# EAGLE design CANFD_module (EAGLE 9.6.2)
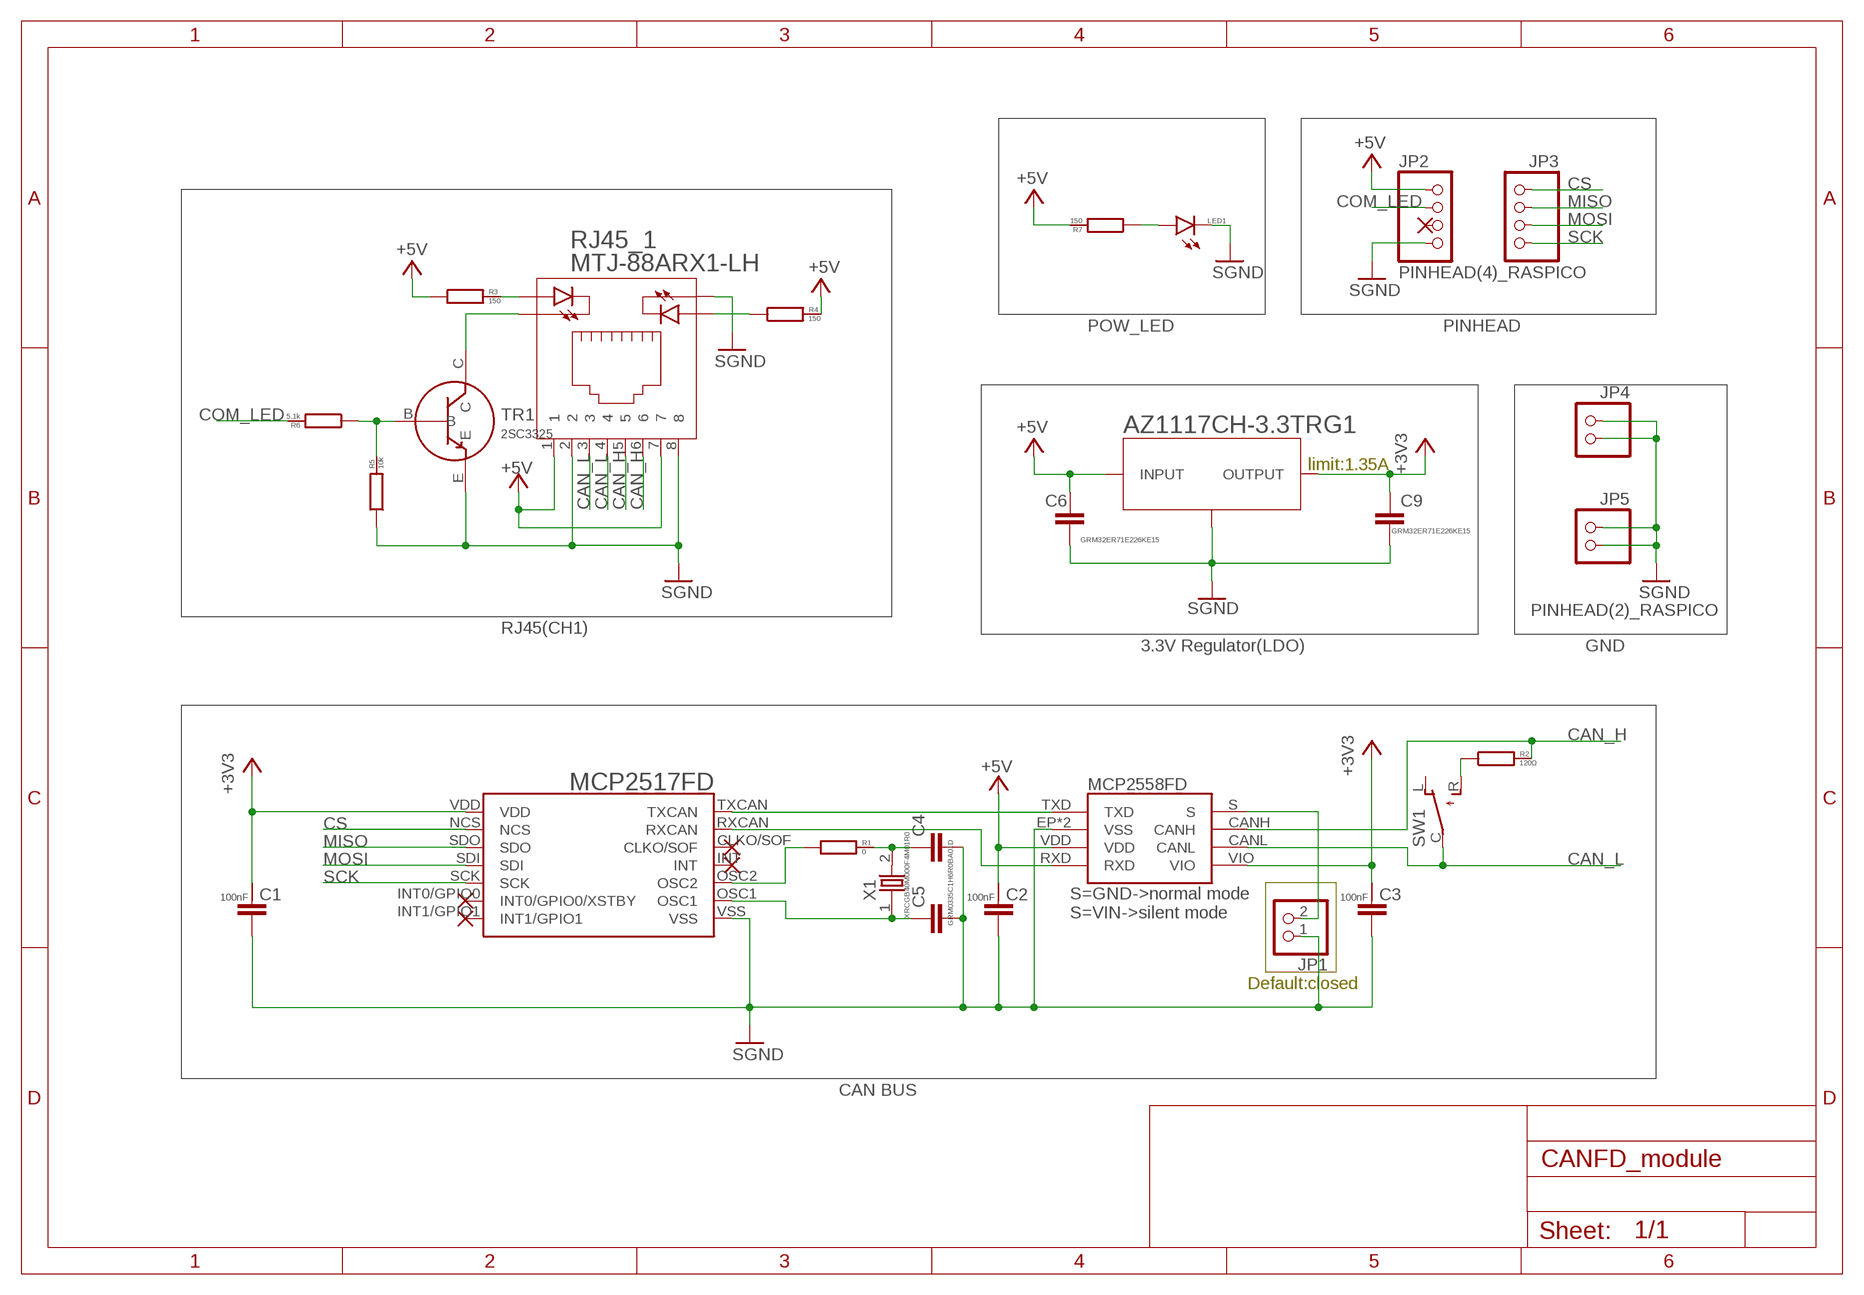
[diagram p0: schematic, sheet 1]

## Parts
C1  GCM188L81H104KA57  [GCM188L81H104KA57]
C2  GCM188L81H104KA57  [GCM188L81H104KA57]
C3  GCM188L81H104KA57  [GCM188L81H104KA57]
C4  GRM0335C1H6R0BA01D  [GRM0335C1H120GA01]
C5  GRM0335C1H6R0BA01D  [GRM0335C1H120GA01]
C6  GRM32ER71E226KE15  [3225M]
C9  GRM32ER71E226KE15  [3225M]
JP1  PINHD-1X2  [1X02]
JP2  PINHEAD(4)_RASPICO  [1X04]
JP3  PINHEAD(4)_RASPICO  [1X04]
JP4  PINHEAD(2)_RASPICO  [PINHEAD_2_RASPICO]
JP5  PINHEAD(2)_RASPICO  [PINHEAD_2_RASPICO]
LED1  SML-E12V8WT86  [SML-E12V8WT86]
R1  0  CR0603  [CR0603]
R2  120Ω  CR0603  [CR0603]
R3  150  CR0603  [CR0603]
R4  150  CR0603  [CR0603]
R5  10k  CR0603  [CR0603]
R6  5.1k  CR0603  [CR0603]
R7  150  CR0603  [CR0603]
RJ45_1  MTJ-88ARX1-LH  [MTJ-88ARX1-LH]
SW1  SS-12SDP2  [SS-12SDP2]
TR1  2SC3325  [2SC3325]
U2  MCP2517FD  [MCP2517FD]
U$1  MCP2558FD  [MCP2558FD]
U$4  AZ1117CH-3.3TRG1  [AZ1117C]
X1  XRCGB40M000F4M01R0  [XRCGB40M000F4M00R0]

## Nets
+3V3: C1.P$1 C3.P$1 C9.L U2.VDD U$1.VIO U$4.OUTPUT U$4.VOUT(OUTPUT)
+5V: C2.P$1 C6.L JP2.PIN1 JP2.PIN1_ R3.LEFT R4.RIGHT R7.RIGHT RJ45_1.1 RJ45_1.7 U$1.VDD U$4.INPUT
CAN_H: R2.RIGHT RJ45_1.5 RJ45_1.6 U$1.CANH
CAN_L: RJ45_1.3 RJ45_1.4 SW1.C U$1.CANL
COM_LED: JP2.PIN2 JP2.PIN2_ R6.RIGHT
CS: JP3.PIN1 JP3.PIN1_ U2.NCS
MISO: JP3.PIN2 JP3.PIN2_ U2.SDO
MOSI: JP3.PIN3 JP3.PIN3_ U2.SDI
N$1: LED1.A R7.LEFT
N$23: R2.LEFT SW1.R
N$27: U2.TXCAN U$1.TXD
N$28: U2.RXCAN U$1.RXD
N$38: R1.LEFT U2.OSC2
N$39: C5.1 U2.OSC1 X1.1
N$42: C4.1 R1.RIGHT X1.2
N$51: R4.LEFT RJ45_1.LED2_A
N$68: JP1.2 U$1.S
N$69: R3.RIGHT RJ45_1.LED1_A
N$71: RJ45_1.LED1_K TR1.C
N$74: R5.RIGHT R6.LEFT TR1.B
SCK: JP3.PIN4 JP3.PIN4_ U2.SCK
SGND: C1.P$2 C2.P$2 C3.P$2 C4.2 C5.2 C6.R C9.R JP1.1 JP2.PIN4 JP2.PIN4_ JP4.PIN1 JP4.PIN1_ JP4.PIN2 JP4.PIN2_ JP5.PIN1 JP5.PIN1_ JP5.PIN2 JP5.PIN2_ LED1.K(C) R5.LEFT RJ45_1.2 RJ45_1.8 RJ45_1.LED2_K TR1.E U2.VSS U$1.EP(VSS) U$1.VSS U$4.GND ; supply symbol labelled GND
Unconnected: JP2.PIN3 JP2.PIN3_ SW1.L U2.CLKO/SOF U2.INT U2.INT0/GPIO0(INT0/GPIO0/XSTBY) U2.INT1/GPIO1

## Notes on the sheet
- POW_LED | PINHEAD
- limit:1.35A
- RJ45(CH1)
- 3.3V Regulator(LDO) | GND
- S=GND->normal mode
  S=VIN->silent mode
- Default:closed
- CAN BUS

## Library data of the parts
C1-C3 = GCM188L81H104K57(0.1uF):GCM188L81H104KA57
C4 C5 = GRM0335C1H6R0BA01D:GRM0335C1H6R0BA01D
C6 C9 = GRM32ER71E226KE15:GRM32ER71E226KE15
JP1 = pinhead:PINHD-1X2: PIN HEADER
JP2 JP3 = raspico_pinhead_4:PINHEAD(4)_RASPICO
JP4 JP5 = raspico_pinhead_2:PINHEAD(2)_RASPICO
LED1 = SML-E12V8WT86:SML-E12V8WT86
R1-R7 = CR0603:CR0603
RJ45_1 = MTJ-88ARX1-LH:MTJ-88ARX1-LH
SW1 = SS-12SDP2:SS-12SDP2
TR1 = 2SC3325:2SC3325
U2 = MCP2517FD:MCP2517FD
U$1 = MCP2558FD:MCP2558FD
U$4 = AZ1117CH-3.3TRG1:AZ1117CH-3.3TRG1
X1 = XRCGB40M000F4M01R0:XRCGB40M000F4M01R0

## Board
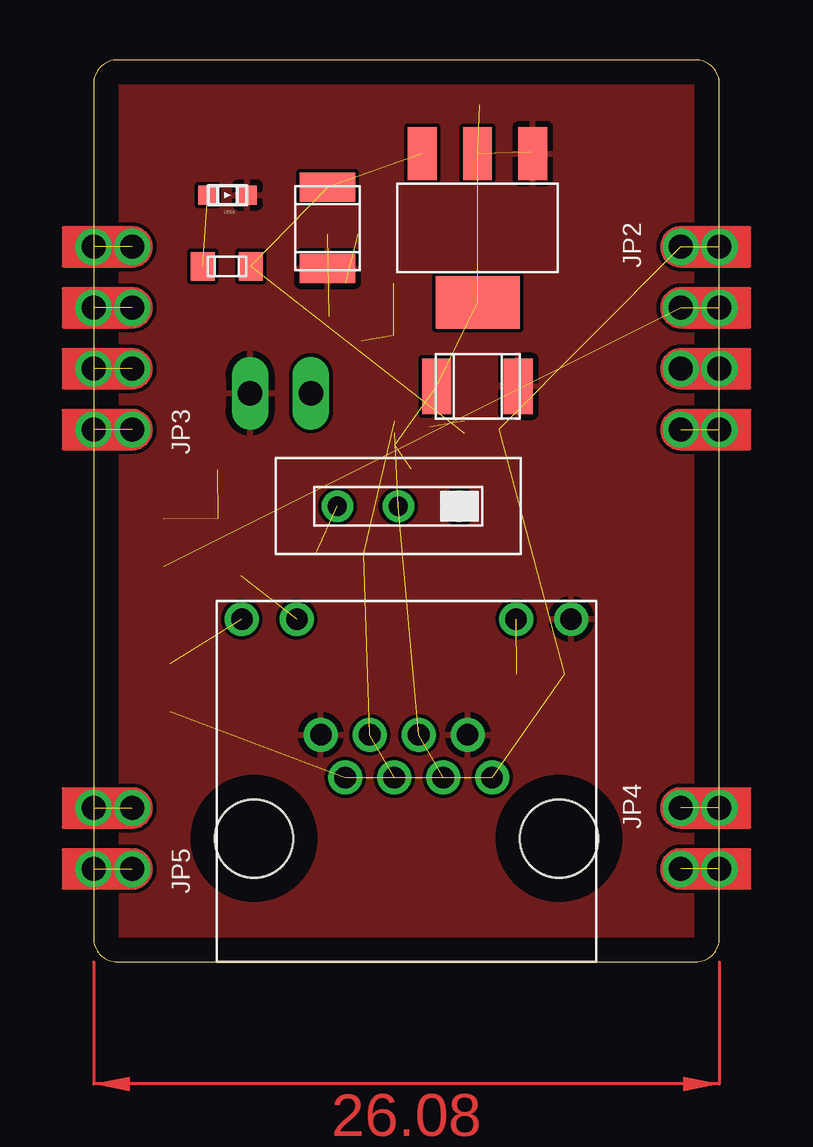
[diagram p1: board, top side]
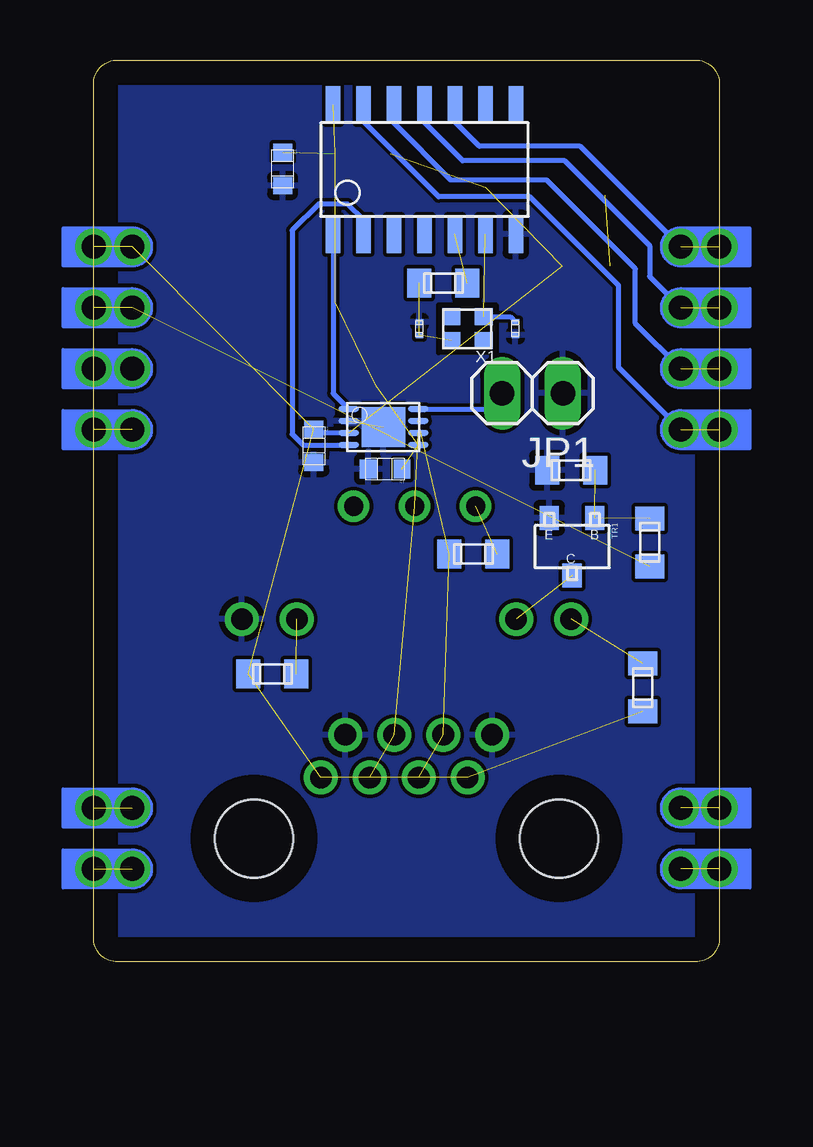
[diagram p2: board, bottom side, seen from below]

Size 26.08 x 37.6 mm. Coordinates in mm from the lower left corner, seen from the top.
Outline: 26.08,1 26.08,36.6 arc90 25.08,37.6 1,37.6 arc90 0,36.6 0,1 arc90 1,0 25.08,0 arc90 26.08,1
Copper layers (1*16): Top 0.035mm / dielectric 1.5mm / Bottom 0.035mm
Design rules "default": minimum track width 6mil, minimum drill 0.35mm, track to track 6mil, track to pad 6mil, pad to pad 6mil, via to via 6mil, smd to smd 6mil, copper to edge 40mil, drill to drill 6mil, minimum pad ring 10mil, minimum via ring 8mil, stop-mask expansion 4mil, vias tented up to drill 0mil, thermal gap 10mil

### Footprints (pad centres in the part's own frame; a part is rotated, then mirrored left to right if it is on the bottom)
GCM188L81H104KA57 = smd 0.7 x 0.8: P$1 -0.7,0; P$2 0.7,0
GRM0335C1H120GA01 = smd 0.25 x 0.3: 1 -0.275,0; 2 0.275,0
3225M = smd 1.2 x 2.3: L -1.7,0; R 1.7,0
1X02 = drill 1.016 long: 1 -1.27,0; 2 1.27,0
1X04 = drill 1: PIN1 -3.81,0; PIN1_ -3.81,1.61; PIN2 -1.27,0; PIN2_ -1.27,1.61; PIN3 1.27,0; PIN3_ 1.27,1.61; PIN4 3.81,0; PIN4_ 3.81,1.61
PINHEAD_2_RASPICO = drill 1: PIN1 -1.27,0; PIN1_ -1.27,1.61; PIN2 1.27,0; PIN2_ 1.27,1.61
SML-E12V8WT86 = smd 0.8 x 0.8: A 0,1.65; K 0,0
CR0603 = smd 1 x 1.2: LEFT -1,0; RIGHT 1,0
MTJ-88ARX1-LH = drill 0.9: 1 9.92,2.54; 2 8.9,4.32; 3 7.88,2.54; 4 6.86,4.32; 5 5.84,2.54; 6 4.82,4.32; 7 3.8,2.54; 8 2.78,4.32; LED1_A -0.51,9.14; LED1_K 1.78,9.14; LED2_A 10.92,9.14; LED2_K 13.21,9.14 | hole 3.25: 0,0; 12.7,0
SS-12SDP2 = drill 0.8 pad 1.3: C 0,0; L -2.54,0; R 2.54,0
2SC3325 = smd 1 x 0.8: B 0,1.9; C 2.4,0.95; E 0,0
MCP2517FD = smd 0.6 x 1.55: CLKO/SOF 2.54,0; INT 3.81,0; INT0/GPIO0 6.35,5.4; INT1/GPIO1 7.62,5.4; NCS 1.27,5.4; OSC1 6.35,0; OSC2 5.08,0; RXCAN 1.27,0; SCK 5.08,5.4; SDI 3.81,5.4; SDO 2.54,5.4; TXCAN 0,0; VDD 0,5.4; VSS 7.62,0
MCP2558FD = smd 0.25 x 0.85: CANH -0.25,1.45; CANL 0.25,1.45; RXD 0.75,-1.45; S -0.75,1.45; TXD -0.75,-1.45; VDD 0.25,-1.45; VIO 0.75,1.45; VSS -0.25,-1.45 | smd 1.65 x 1.8: EP 0,0
AZ1117C = smd 1.2 x 2.2: GND -2.3,-3.1; INPUT 2.3,-3.1; OUTPUT 0,-3.1 | smd 3.5 x 2.2: VOUT 0,3.1
XRCGB40M000F4M00R0 = smd 0.75 x 0.7: 1 -0.675,-0.5; 2 0.675,0.5; NC1 -0.675,0.5; NC2 0.675,-0.5

### Placement (x,y rotation side)
C1  13.93,20.55 180 bottom
C2  16.9,21.52 270 bottom
C3  18.2,33.06 270 bottom
C4  12.5,26.4 90 bottom
C5  8.5,26.4 270 bottom
C6  9.75,30.6 270 top
C9  16,24 0 top
JP1  7.79,23.71 180 bottom
JP2  24.47,26 270 top
JP3  1.61,26 90 top
JP4  24.47,5.15 270 top
JP5  1.61,5.15 90 top
LED1  6.41,31.97 90 top
R1  11.5,28.3 180 bottom
R2  10.25,17.01 180 bottom
R3  3.19,11.44 90 bottom
R4  18.63,12.01 180 bottom
R5  6.18,20.5 0 bottom
R6  2.91,17.49 270 bottom
R7  5.56,29 0 top
RJ45_1  6.69,5.15 0 top
SW1  12.7,19 180 top
TR1  7.09,18.51 270 bottom
U2  16.1,30.33 0 bottom
U$1  14,22.3 270 bottom
U$4  16,30.6 180 top
X1  10.5,26.4 180 bottom

### Tracks (layer width: path | path; a pad name or v marks a point on that pad's centre or on a via)
+3V3  (6 unrouted)
+5V  (9 unrouted)
  Bottom 0.2: U$1.VDD 16.73,22.05 C2.P$1
CAN_H  (3 unrouted)
CAN_L  (3 unrouted)
COM_LED  (2 unrouted)
CS  (1 unrouted)
  Bottom 0.2: JP3.PIN1 4.2,24.78 4.2,28.2 7.9,31.9 11.7,31.9 14.83,35.03 U2.NCS
MISO  (1 unrouted)
  Bottom 0.2: JP3.PIN2 3.5,26.62 3.5,28.9 7.2,32.6 11.2,32.6 13.56,34.96 U2.SDO
MOSI  (1 unrouted)
  Bottom 0.2: JP3.PIN3 2.91,28.57 2.91,29.87 6.44,33.4 10.7,33.4 12.3,35 U2.SDI
N$1  (1 unrouted)
N$23  (1 unrouted)
N$27
  Bottom 0.2: U2.TXCAN 16.1,23.7 U$1.TXD
N$28
  Bottom 0.2: U2.RXCAN 14.83,30.93 15.5,31.6 16.7,31.6 17.8,30.5 17.8,22 17.35,21.55 U$1.RXD
N$38  (1 unrouted)
N$39  (1 unrouted)
  Bottom 0.2: X1.1 8.72,26.9 C5.1
N$42  (2 unrouted)
N$51  (1 unrouted)
N$68
  Bottom 0.2: U$1.S 9.72,23.05 JP1.2
N$69  (1 unrouted)
N$71  (1 unrouted)
N$74  (2 unrouted)
SCK  (1 unrouted)
  Bottom 0.2: JP3.PIN4 5.8,34 10,34 11.02,35.02 U2.SCK
SGND  (6 unrouted)
  pour Bottom: -6,42 -6,-6 31,-6 31,41 30.29,41.71 arc45 29.59,42
  pour Top: -7,42 -7,-6 30,-6 30,41 29.29,41.71 arc45 28.59,42
  cutout Bottom: 9.3,27.4 9.3,25.4 11.7,25.4 11.7,27.4
(copper drawn outside any net)
  shapes: Top area x1